# EAGLE design tlc5940_1 (EAGLE 7.3.0)
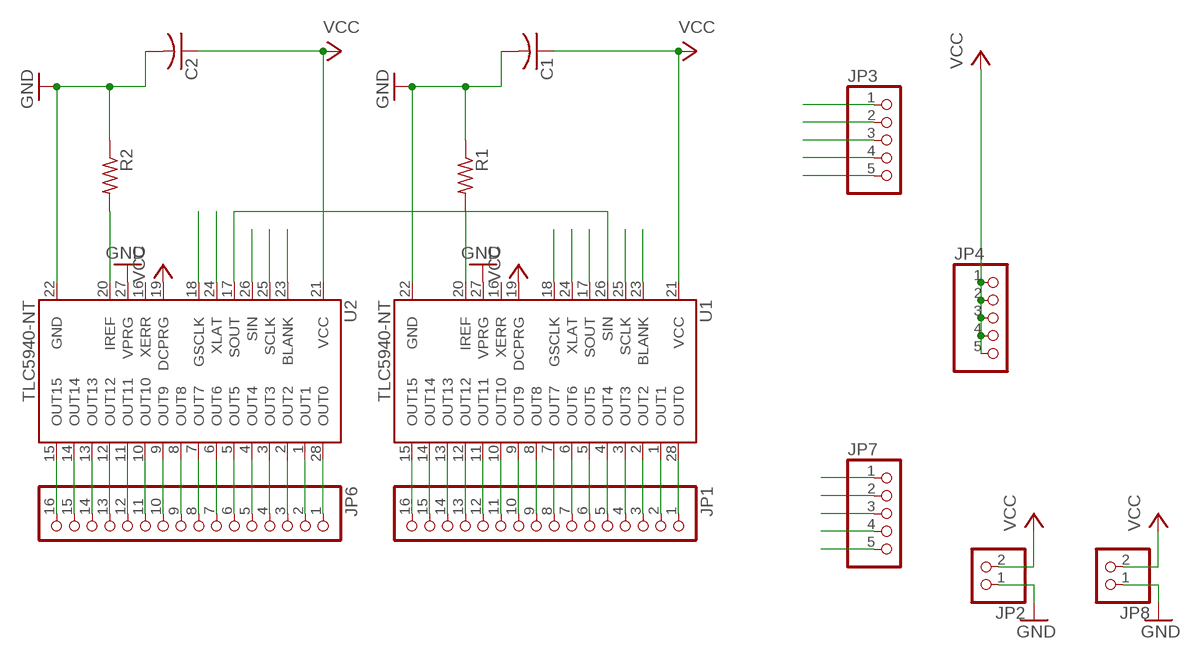
[diagram p0: schematic, sheet 1]

## Parts
C1  C-US025-024X044  [C025-024X044]
C2  C-US025-024X044  [C025-024X044]
JP1  PINHD-1X16  [1X16]
JP2  PINHD-1X2  [1X02]
JP3  PINHD-1X5  [1X05]
JP4  PINHD-1X5  [1X05]
JP6  PINHD-1X16  [1X16]
JP7  PINHD-1X5  [1X05]
JP8  PINHD-1X2  [1X02]
R1  R-US_0613/5V  [P0613V]
R2  R-US_0613/5V  [P0613V]
U1  TLC5940-NT  [DIL28-3]
U2  TLC5940-NT  [DIL28-3]

## Nets
BLANK: JP3.5 JP7.5 U1.23(BLANK) U2.23(BLANK)
GND: C1.2 C2.2 JP2.1 JP8.1 R1.1 R2.1 U1.22(GND) U1.27(VPRG) U2.22(GND) U2.27(VPRG)
GSCLK: JP3.1 JP7.1 U1.18(GSCLK) U2.18(GSCLK)
N$1: JP1.1 U1.28(OUT0)
N$2: JP1.2 U1.1(OUT1)
N$3: JP1.3 U1.2(OUT2)
N$4: JP1.4 U1.3(OUT3)
N$5: JP1.5 U1.4(OUT4)
N$6: JP1.6 U1.5(OUT5)
N$7: JP1.7 U1.6(OUT6)
N$8: JP1.8 U1.7(OUT7)
N$9: JP1.9 U1.8(OUT8)
N$10: JP1.10 U1.9(OUT9)
N$11: JP1.11 U1.10(OUT10)
N$12: JP1.12 U1.11(OUT11)
N$13: JP1.13 U1.12(OUT12)
N$14: JP1.14 U1.13(OUT13)
N$15: JP1.15 U1.14(OUT14)
N$16: JP1.16 U1.15(OUT15)
N$17: R1.2 U1.20(IREF)
N$18: U1.26(SIN) U2.17(SOUT)
N$28: JP6.1 U2.28(OUT0)
N$29: JP6.2 U2.1(OUT1)
N$30: JP6.3 U2.2(OUT2)
N$31: JP6.4 U2.3(OUT3)
N$32: JP6.5 U2.4(OUT4)
N$33: JP6.6 U2.5(OUT5)
N$34: JP6.7 U2.6(OUT6)
N$35: JP6.8 U2.7(OUT7)
N$36: JP6.9 U2.8(OUT8)
N$37: JP6.10 U2.9(OUT9)
N$38: JP6.11 U2.10(OUT10)
N$39: JP6.12 U2.11(OUT11)
N$40: JP6.13 U2.12(OUT12)
N$41: JP6.14 U2.13(OUT13)
N$42: JP6.15 U2.14(OUT14)
N$43: JP6.16 U2.15(OUT15)
N$44: R2.2 U2.20(IREF)
SCLK: JP3.4 JP7.4 U1.25(SCLK) U2.25(SCLK)
SIN: JP3.3 U2.26(SIN)
SOUT: JP7.3 U1.17(SOUT)
VCC: C1.1 C2.1 JP2.2 JP4.1 JP4.2 JP4.3 JP4.4 JP4.5 JP8.2 U1.19(DCPRG) U1.21(VCC) U2.19(DCPRG) U2.21(VCC)
XLAT: JP3.2 JP7.2 U1.24(XLAT) U2.24(XLAT)
Unconnected: U1.16(XERR) U2.16(XERR)

## Library data of the parts
C1 C2 = resistor:C-US: CAPACITOR, American symbol
JP1 JP6 = pinhead:PINHD-1X16: PIN HEADER
JP2 JP8 = pinhead:PINHD-1X2: PIN HEADER
JP3 JP4 JP7 = pinhead:PINHD-1X5: PIN HEADER
R1 R2 = resistor:R-US_: RESISTOR, American symbol
U1 U2 = SparkFun-DigitalIC:TLC5940: 16-channel LED Driver with Dot Correction and Grayscale PWM Control The TLC5940 is a 16-channel, constant-current sink LED driver. Each channel has an individually adjustable 4096-step grayscale PWM brightness control and a 64-step, constant-current sink (dot correction). The dot correction adjusts the brightness variations between LED channels and other LED drivers. The dot correction data is stored in an integrated EEPROM. Both grayscale control and dot correction are accessible via a serial interface. A single external resistor sets the maximum current value of all 16 channels. Packages: 28-pin HTSSOP 32-pin 5x5mm QFN 28-pin DIP

## Board
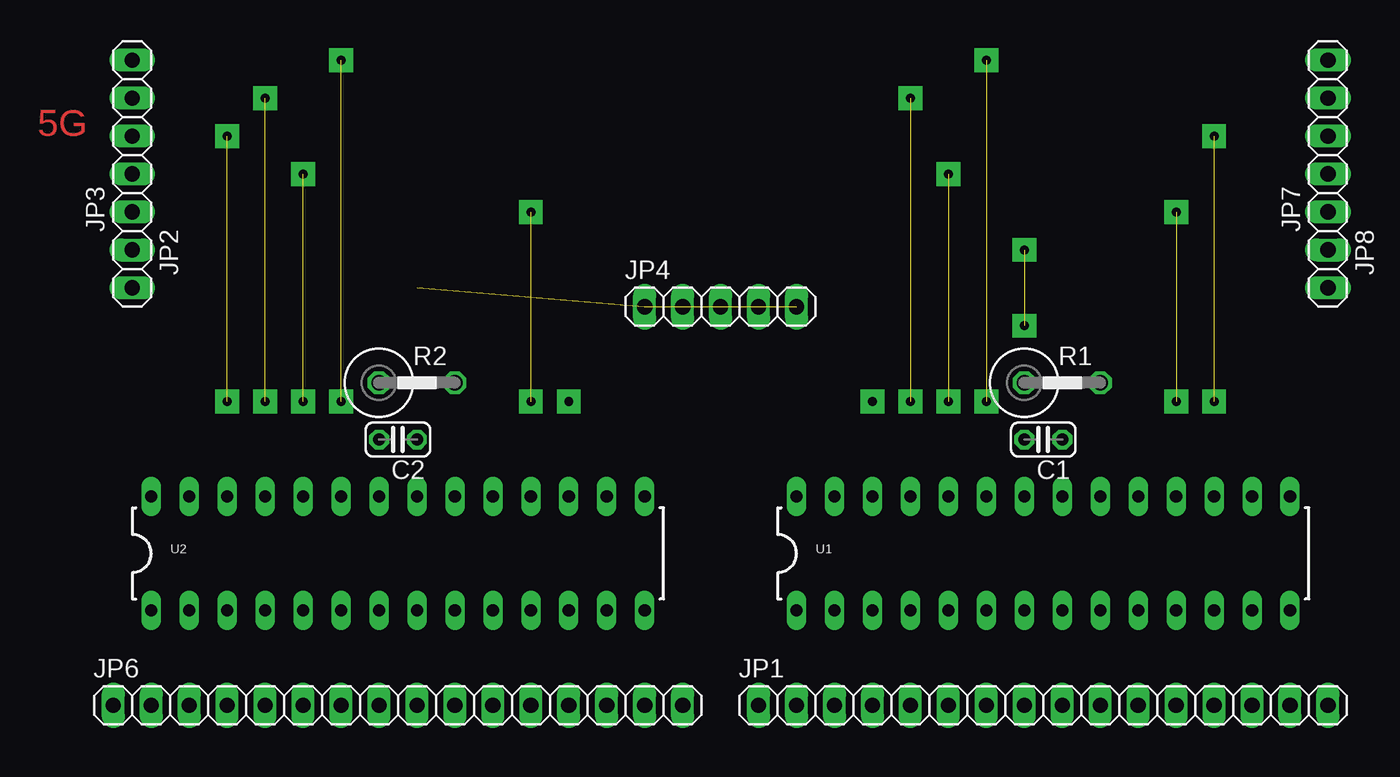
[diagram p1: board, top side]
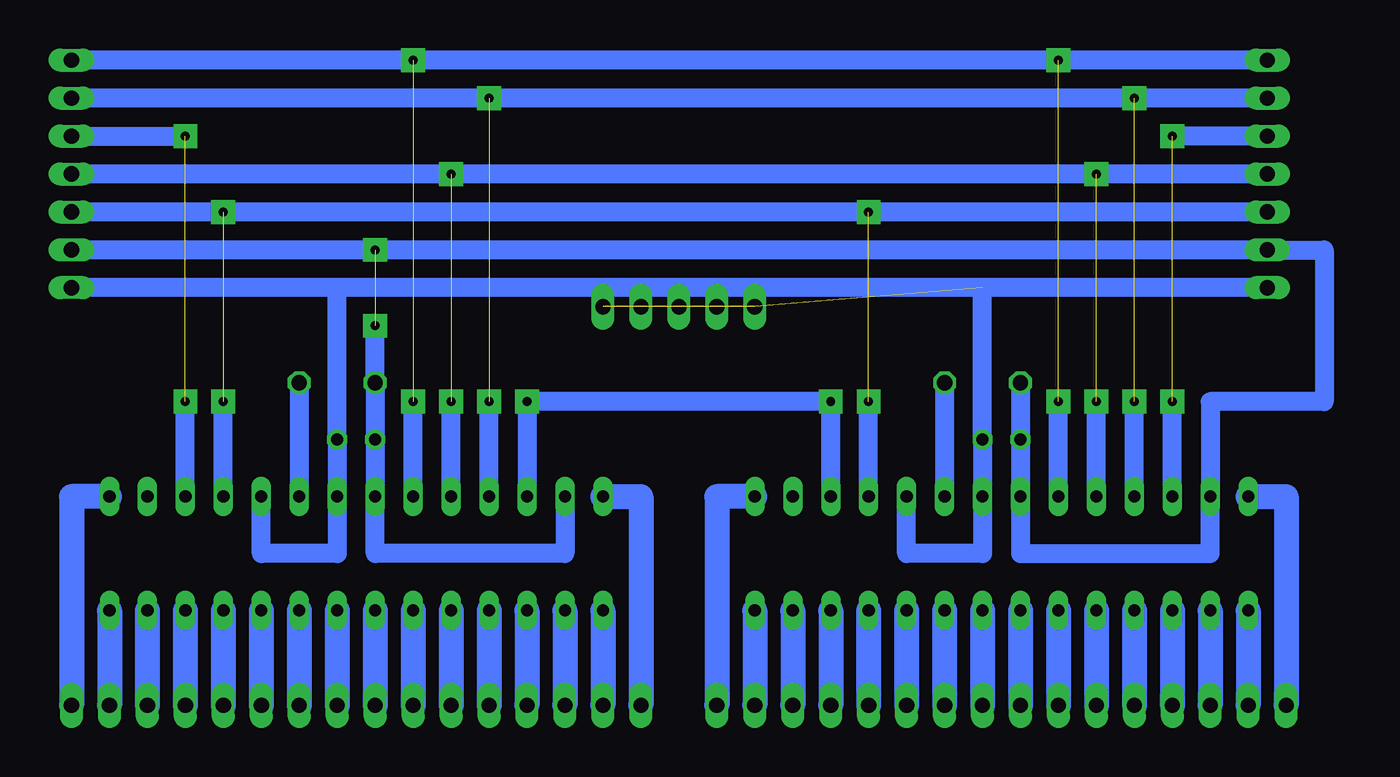
[diagram p2: board, bottom side, seen from below]

No outline drawn. Coordinates in mm, seen from the top.
Copper layers (1*16): Top 0.035mm / dielectric 1.5mm / Bottom 0.035mm
Design rules "default *": minimum track width 10mil, minimum drill 24mil, track to track 0mil, track to pad 0mil, pad to pad 0mil, via to via 0mil, smd to smd 0mil, copper to edge 40mil, drill to drill 8mil, minimum pad ring 10mil, minimum via ring 8mil, stop-mask expansion 4mil, vias tented up to drill 0mil, thermal gap 10mil

### Footprints (pad centres in the part's own frame; a part is rotated, then mirrored left to right if it is on the bottom)
C025-024X044 = drill 0.813 octagon: 1 -1.27,0; 2 1.27,0
1X16 = drill 1.016 long: 1 -19.05,0; 2 -16.51,0; 3 -13.97,0; 4 -11.43,0; 5 -8.89,0; 6 -6.35,0; 7 -3.81,0; 8 -1.27,0; 9 1.27,0; 10 3.81,0; 11 6.35,0; 12 8.89,0; 13 11.43,0; 14 13.97,0; 15 16.51,0; 16 19.05,0
1X02 = drill 1.016 long: 1 -1.27,0; 2 1.27,0
1X05 = drill 1.016 long: 1 -5.08,0; 2 -2.54,0; 3 0,0; 4 2.54,0; 5 5.08,0
P0613V = drill 1.016 octagon: 1 -2.54,0; 2 2.54,0
DIL28-3 = drill 0.813 long: 1 -16.51,-3.81; 2 -13.97,-3.81; 3 -11.43,-3.81; 4 -8.89,-3.81; 5 -6.35,-3.81; 6 -3.81,-3.81; 7 -1.27,-3.81; 8 1.27,-3.81; 9 3.81,-3.81; 10 6.35,-3.81; 11 8.89,-3.81; 12 11.43,-3.81; 13 13.97,-3.81; 14 16.51,-3.81; 15 16.51,3.81; 16 13.97,3.81; 17 11.43,3.81; 18 8.89,3.81; 19 6.35,3.81; 20 3.81,3.81; 21 1.27,3.81; 22 -1.27,3.81; 23 -3.81,3.81; 24 -6.35,3.81; 25 -8.89,3.81; 26 -11.43,3.81; 27 -13.97,3.81; 28 -16.51,3.81

### Placement (x,y rotation side)
C1  68.58,39.37 180 top
C2  25.4,39.37 180 top
JP1  68.58,21.59 0 top
JP2  7.62,50.8 270 top
JP3  7.62,59.69 90 top
JP4  46.99,48.26 0 top
JP6  25.4,21.59 0 top
JP7  87.63,59.69 90 top
JP8  87.63,50.8 270 top
R1  69.85,43.18 0 top
R2  26.67,43.18 0 top
U1  68.58,31.75 0 top
U2  25.4,31.75 0 top

### Tracks (layer width: path | path; a pad name or v marks a point on that pad's centre or on a via)
BLANK  (via drill 0.6 pad 1.6)  (2 unrouted)
  Bottom 1.27: JP3.5 v21.59,64.77 v64.77,64.77 JP7.5 | U2.23 21.59,41.91 | U1.23 64.77,41.91
GND  (via drill 0.6 pad 1.6)  (1 unrouted)
  Bottom 1.27: JP8.1 v67.31,52.07 JP2.1 3.81,52.07 3.81,41.91 11.43,41.91 U2.27 11.43,31.75 24.13,31.75 U2.22 C2.2 R2.1 | U1.27 54.61,31.75 67.31,31.75 U1.22 C1.2 R1.1 67.31,46.99
GSCLK  (via drill 0.6 pad 1.6)  (2 unrouted)
  Bottom 1.27: JP3.1 v34.29,54.61 v77.47,54.61 JP7.1 | U2.18 34.29,41.91 | U1.18 77.47,41.91
N$1
  Bottom 1.676: U1.28 49.53,35.56 JP1.1
N$2
  Bottom 1.676: U1.1 JP1.2
N$3
  Bottom 1.676: U1.2 JP1.3
N$4
  Bottom 1.676: U1.3 JP1.4
N$5
  Bottom 1.676: U1.4 JP1.5
N$6
  Bottom 1.676: U1.5 JP1.6
N$7
  Bottom 1.676: U1.6 JP1.7
N$8
  Bottom 1.676: U1.7 JP1.8
N$9
  Bottom 1.676: U1.8 JP1.9
N$10
  Bottom 1.676: U1.9 JP1.10
N$11
  Bottom 1.676: U1.10 JP1.11
N$12
  Bottom 1.676: U1.11 JP1.12
N$13
  Bottom 1.676: U1.12 JP1.13
N$14
  Bottom 1.676: U1.13 JP1.14
N$15
  Bottom 1.676: U1.14 JP1.15
N$16
  Bottom 1.676: U1.15 87.63,35.56 JP1.16
N$17
  Bottom 1.27: R1.2 U1.20
N$18
  Bottom 1.27: U2.17 36.83,41.91 57.15,41.91 U1.26
N$19  (via drill 0.6 pad 1.6)
  other vias: 13.97,41.91
N$20  (via drill 0.6 pad 1.6)
  other vias: 16.51,41.91
N$21  (via drill 0.6 pad 1.6)
  other vias: 19.05,41.91
N$22  (via drill 0.6 pad 1.6)
  other vias: 21.59,41.91
N$23  (via drill 0.6 pad 1.6)
  other vias: 34.29,41.91
N$24  (via drill 0.6 pad 1.6)
  other vias: 36.83,41.91
N$25  (via drill 0.6 pad 1.6)
  other vias: 59.69,41.91
N$26  (via drill 0.6 pad 1.6)
  other vias: 62.23,41.91
N$27  (via drill 0.6 pad 1.6)
  other vias: 64.77,41.91
N$28
  Bottom 1.676: U2.28 6.35,35.56 JP6.1
N$29
  Bottom 1.676: U2.1 JP6.2
N$30
  Bottom 1.676: U2.2 JP6.3
N$31
  Bottom 1.676: U2.3 JP6.4
N$32
  Bottom 1.676: U2.4 JP6.5
N$33
  Bottom 1.676: U2.5 JP6.6
N$34
  Bottom 1.676: U2.6 JP6.7
N$35
  Bottom 1.676: U2.7 JP6.8
N$36
  Bottom 1.676: U2.8 JP6.9
N$37
  Bottom 1.676: U2.9 JP6.10
N$38
  Bottom 1.676: U2.10 JP6.11
N$39
  Bottom 1.676: U2.11 JP6.12
N$40
  Bottom 1.676: U2.12 JP6.13
N$41
  Bottom 1.676: U2.13 JP6.14
N$42
  Bottom 1.676: U2.14 JP6.15
N$43
  Bottom 1.676: U2.15 44.45,35.56 JP6.16
N$44
  Bottom 1.27: R2.2 U2.20
N$45  (via drill 0.6 pad 1.6)
  other vias: 57.15,41.91
N$46  (via drill 0.6 pad 1.6)
  other vias: 77.47,41.91
N$47  (via drill 0.6 pad 1.6)
  other vias: 80.01,41.91
N$50  (via drill 0.6 pad 1.6)
  other vias: 67.31,46.99
SCLK  (via drill 0.6 pad 1.6)  (2 unrouted)
  Bottom 1.27: JP3.4 v16.51,62.23 v59.69,62.23 JP7.4 | U2.25 16.51,41.91 | U1.25 59.69,41.91
SIN  (via drill 0.6 pad 1.6)  (1 unrouted)
  Bottom 1.27: JP3.3 v13.97,59.69 | U2.26 13.97,41.91
SOUT  (via drill 0.6 pad 1.6)  (1 unrouted)
  Bottom 1.27: JP7.3 v80.01,59.69 | U1.17 80.01,41.91
VCC  (5 unrouted)
  Bottom 1.27: JP2.2 26.67,49.53 | 26.67,49.53 69.85,49.53 | 69.85,49.53 JP8.2 | U2.19 31.75,31.75 26.67,31.75 U2.21 C2.1 26.67,49.53 | U1.19 74.93,31.75 69.85,31.75 U1.21 C1.1 69.85,49.53
XLAT  (via drill 0.6 pad 1.6)  (2 unrouted)
  Bottom 1.27: JP3.2 v19.05,57.15 v62.23,57.15 JP7.2 | U2.24 19.05,41.91 | U1.24 62.23,41.91

### Text on the board
Top: 5G